# Altium schematic sheet HDR-IDC-2.54-2X8PHDR-IDC-2.54-2X8P.schdoc
size 127 x 101 mm
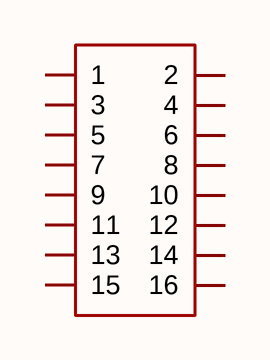
[diagram p0: HDR-IDC-2.54-2X8PHDR-IDC-2.54-2X8P.schdoc]

## Parts
P?  (no value)

## Nets

Not connected (* = marked no-connect by the designer): P? 1 2 3 4 5 6 7 8 9 10 11 12 13 14 15 16

## Library data of the parts
P? = HDR-IDC-2.54-2X8P: Symbol: HDR-IDC-2.54-2X8P